# EAGLE design เเสง (EAGLE 9.1.0)
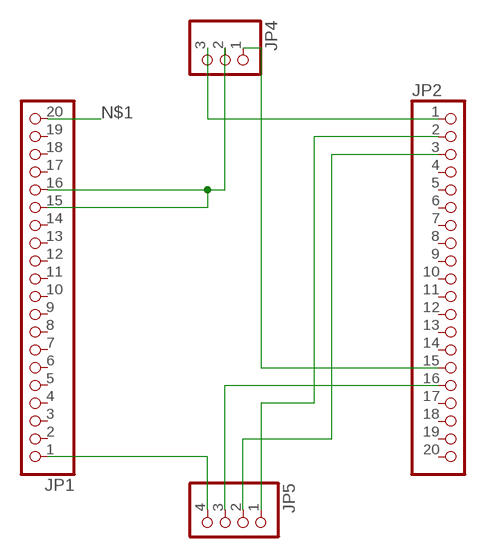
[diagram p0: schematic, sheet 1]

## Parts
JP1  PINHD-1X20  [1X20]
JP2  PINHD-1X20  [1X20]
JP4  PINHD-1X3  [1X03]
JP5  PINHD-1X4  [1X04]

## Nets
N$1: JP1.20
N$2: JP1.15 JP1.16 JP4.2
N$3: JP2.1 JP4.3
N$4: JP2.15 JP4.1
N$5: JP1.1 JP5.4
N$6: JP2.3 JP5.2
N$7: JP2.2 JP5.1
N$8: JP2.16 JP5.3
Unconnected: JP1.2 JP1.3 JP1.4 JP1.5 JP1.6 JP1.7 JP1.8 JP1.9 JP1.10 JP1.11 JP1.12 JP1.13 JP1.14 JP1.17 JP1.18 JP1.19 JP2.4 JP2.5 JP2.6 JP2.7 JP2.8 JP2.9 JP2.10 JP2.11 JP2.12 JP2.13 JP2.14 JP2.17 JP2.18 JP2.19 JP2.20

## Library data of the parts
JP1 JP2 = pinhead:PINHD-1X20: PIN HEADER
JP4 = pinhead:PINHD-1X3: PIN HEADER
JP5 = pinhead:PINHD-1X4: PIN HEADER

## Board
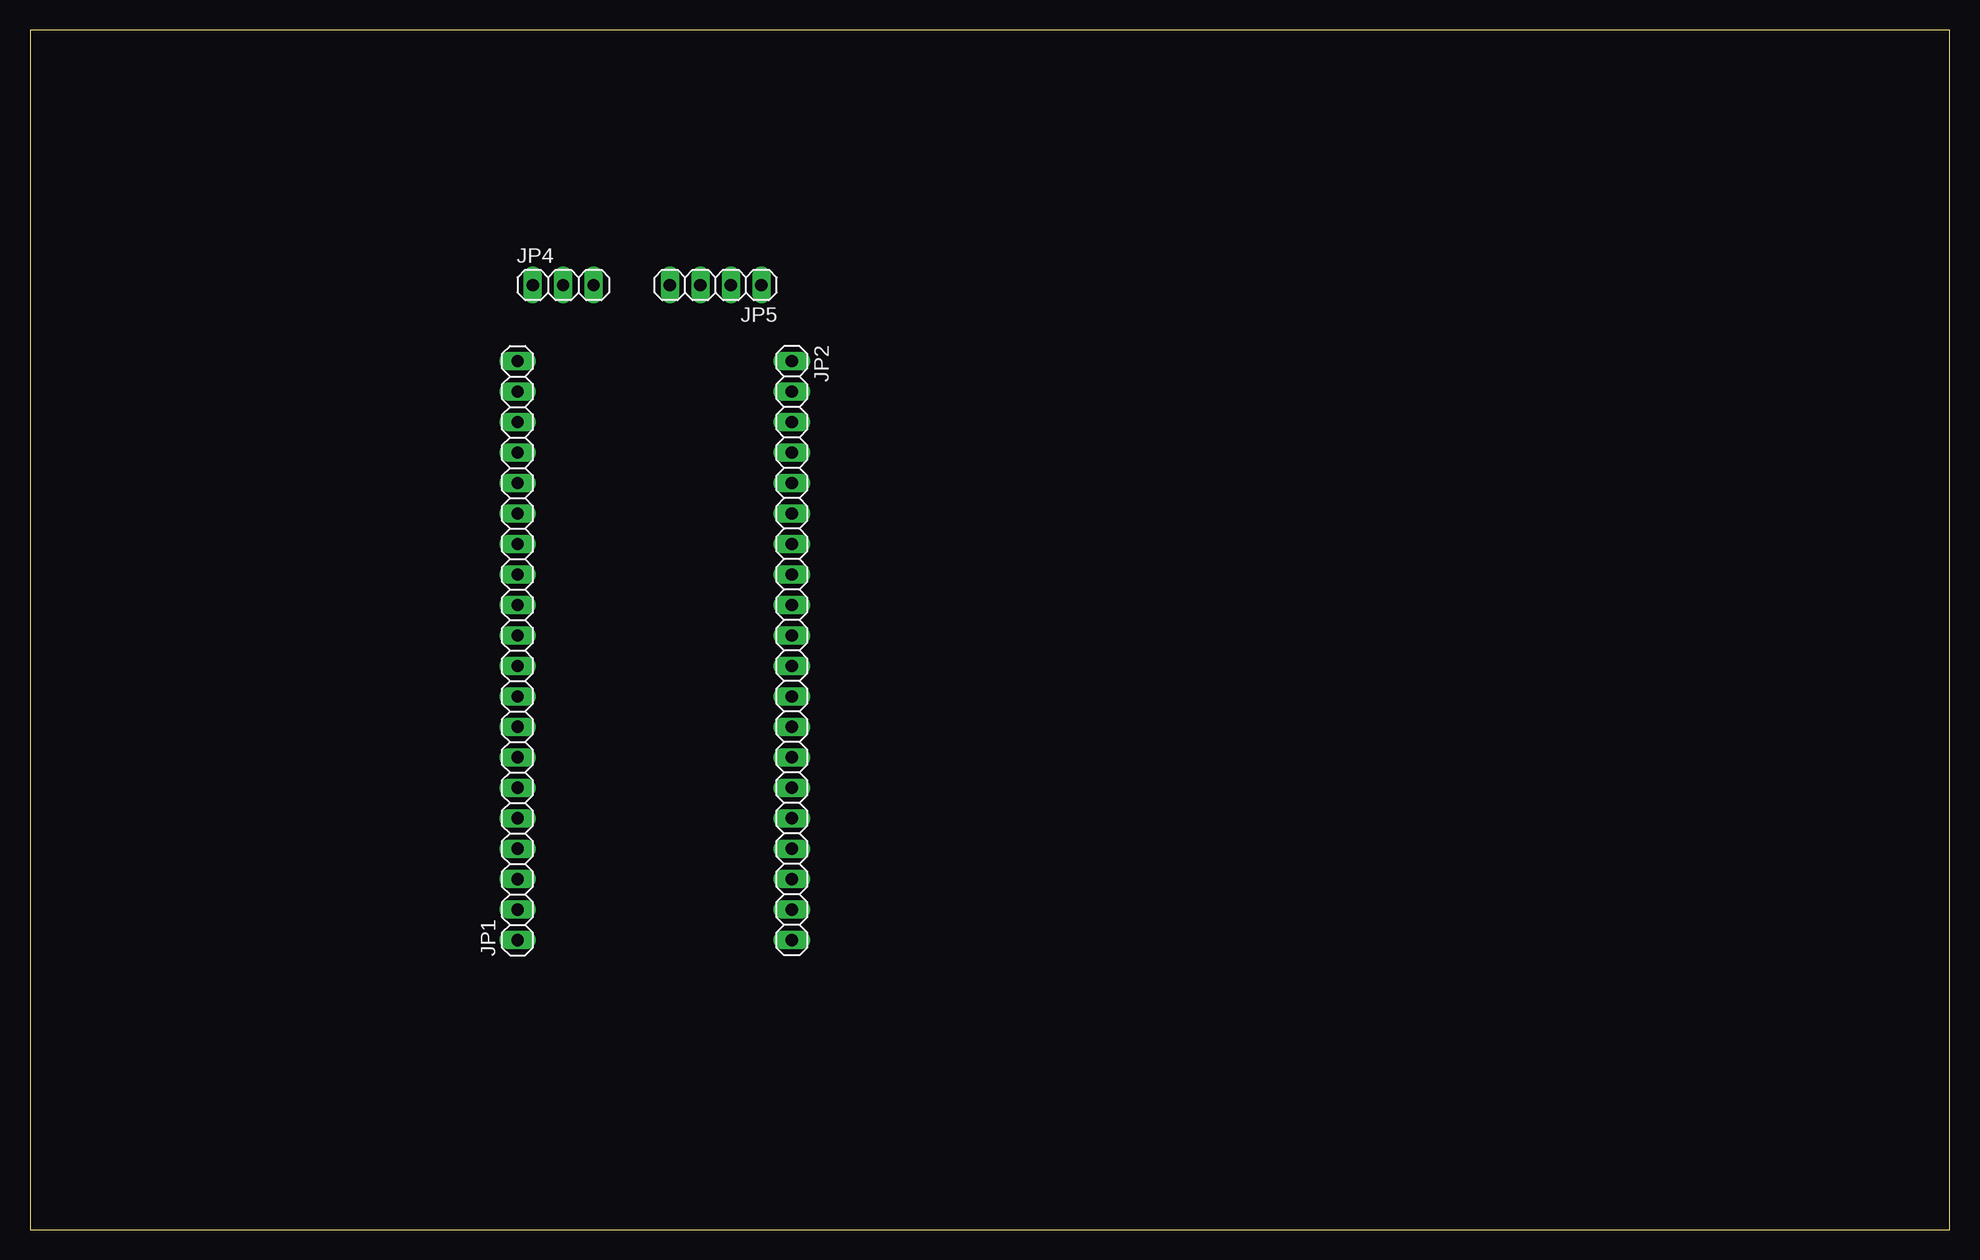
[diagram p1: board, top side]
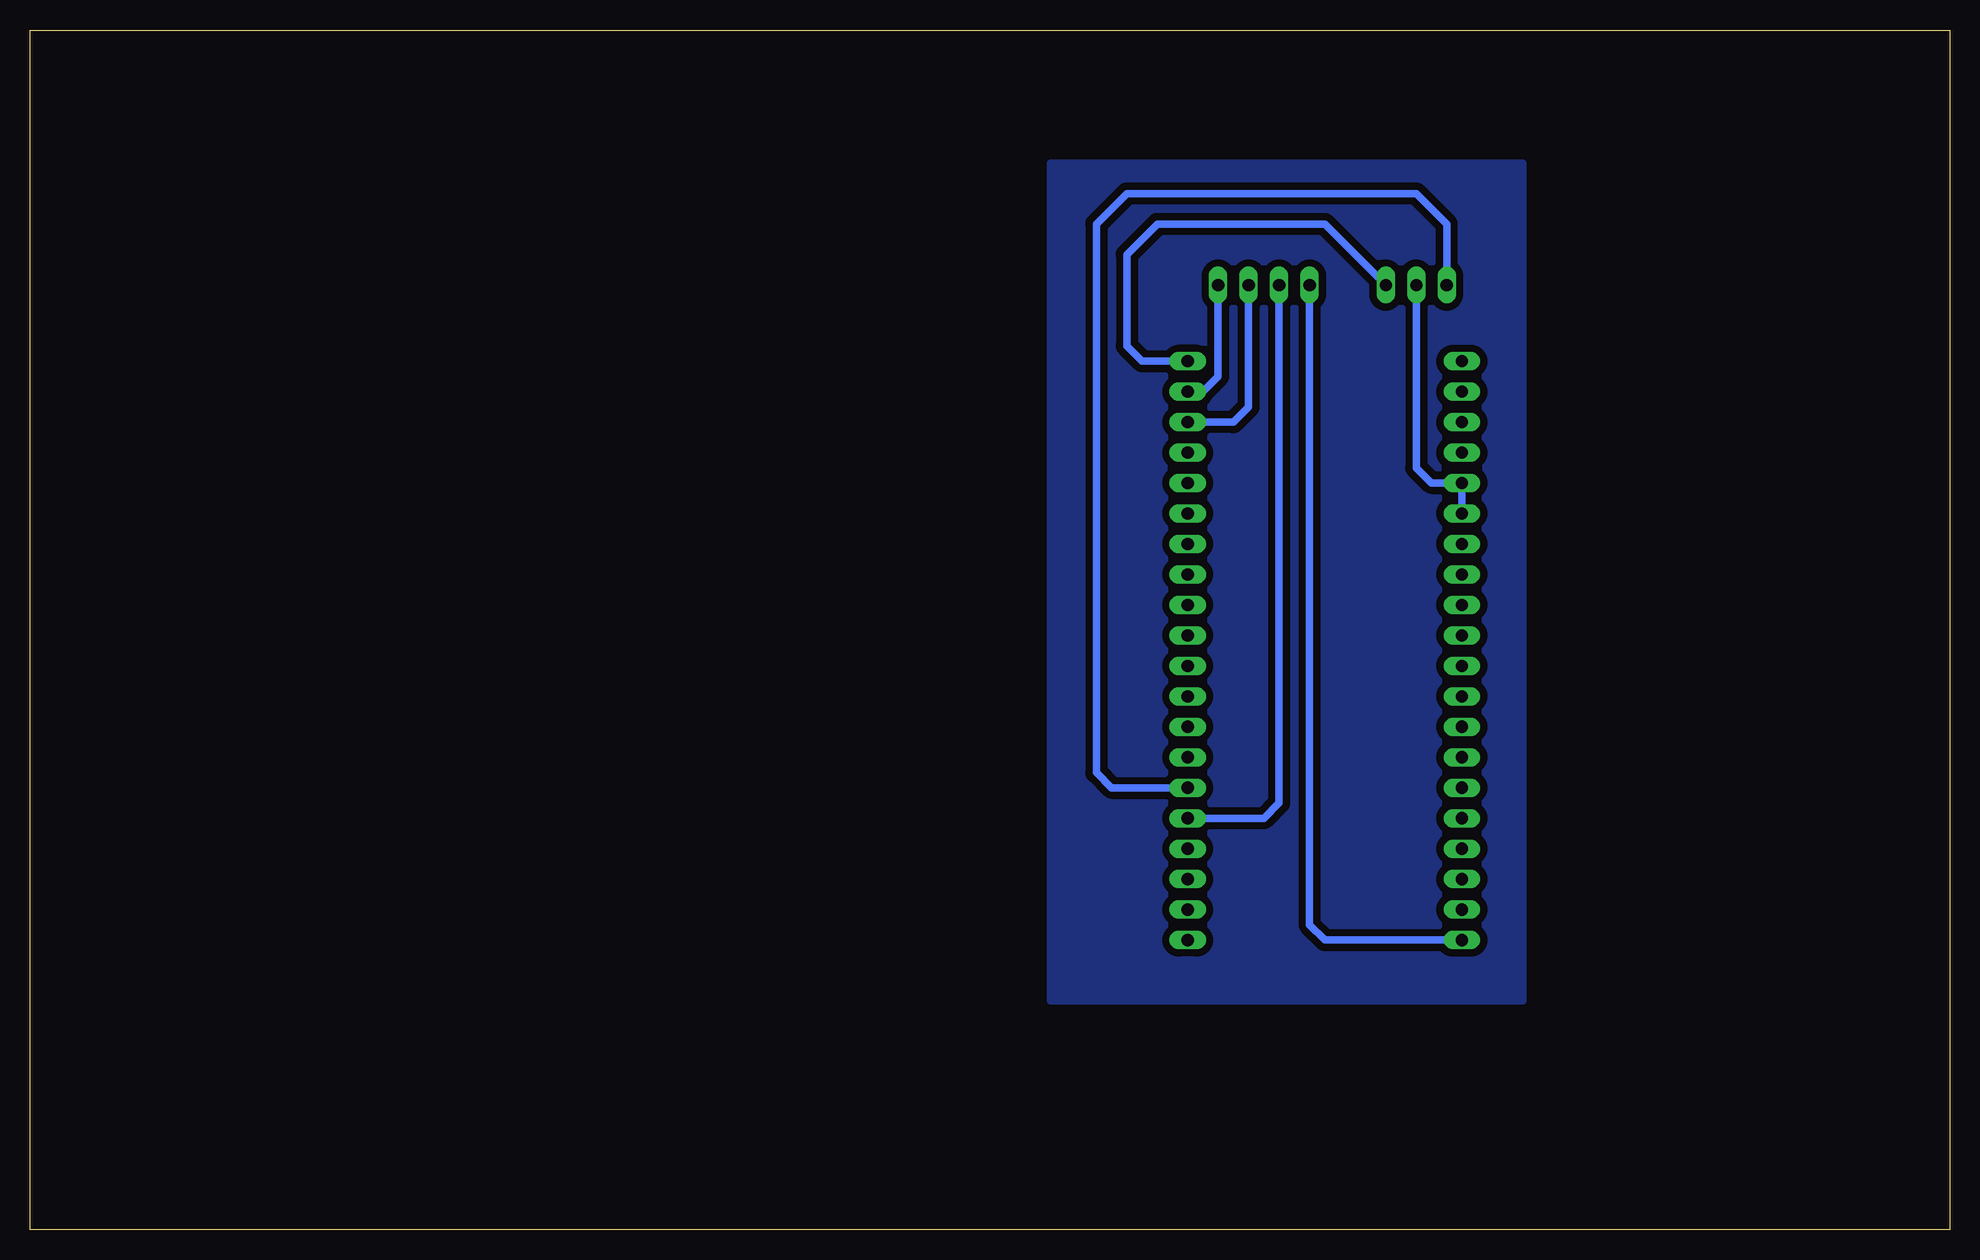
[diagram p2: board, bottom side, seen from below]

Size 160 x 100 mm. Coordinates in mm from the lower left corner, seen from the top.
Outline: 0,0 160,0 160,100 0,100 0,0
Copper layers (1*16): Top 0.035mm / dielectric 1.5mm / Bottom 0.035mm
Design rules "default": minimum track width 6mil, minimum drill 0.35mm, track to track 6mil, track to pad 6mil, pad to pad 6mil, via to via 6mil, smd to smd 6mil, copper to edge 40mil, drill to drill 6mil, minimum pad ring 10mil, minimum via ring 8mil, stop-mask expansion 4mil, vias tented up to drill 0mil, thermal gap 10mil

### Footprints (pad centres in the part's own frame; a part is rotated, then mirrored left to right if it is on the bottom)
1X20 = drill 1.016 long: 1 -24.13,0; 2 -21.59,0; 3 -19.05,0; 4 -16.51,0; 5 -13.97,0; 6 -11.43,0; 7 -8.89,0; 8 -6.35,0; 9 -3.81,0; 10 -1.27,0; 11 1.27,0; 12 3.81,0; 13 6.35,0; 14 8.89,0; 15 11.43,0; 16 13.97,0; 17 16.51,0; 18 19.05,0; 19 21.59,0; 20 24.13,0
1X03 = drill 1.016 long: 1 -2.54,0; 2 0,0; 3 2.54,0
1X04 = drill 1.016 long: 1 -3.81,0; 2 -1.27,0; 3 1.27,0; 4 3.81,0

### Placement (x,y rotation side)
JP1  40.64,48.26 90 top
JP2  63.5,48.26 270 top
JP4  44.45,78.74 0 top
JP5  57.15,78.74 180 top

### Tracks (layer width: path | path; a pad name or v marks a point on that pad's centre or on a via)
GND
  pour Bottom (isolate 0.61, hatched): 35.56,87.63 35.56,19.05 74.93,19.05 74.93,87.63 74.93,88.9 35.56,88.9
N$2
  Bottom 0.61: JP4.2 44.45,63.5 43.18,62.23 JP1.16 JP1.15
N$3
  Bottom 0.61: JP4.3 52.07,83.82 66.04,83.82 68.58,81.28 68.58,73.66 67.31,72.39 JP2.1
N$4
  Bottom 0.61: JP4.1 41.91,83.82 44.45,86.36 68.58,86.36 71.12,83.82 71.12,38.1 69.85,36.83 JP2.15
N$5
  Bottom 0.61: JP5.4 53.34,25.4 52.07,24.13 JP1.1
N$6
  Bottom 0.61: JP5.2 58.42,68.58 59.69,67.31 JP2.3
N$7
  Bottom 0.61: JP5.1 60.96,71.12 62.23,69.85 JP2.2
N$8
  Bottom 0.61: JP5.3 55.88,35.56 57.15,34.29 JP2.16